# Altium schematic sheet Precision FBR & dB Converter.SchDoc
size Letter; SheetNumber: 3; SheetTotal: 14
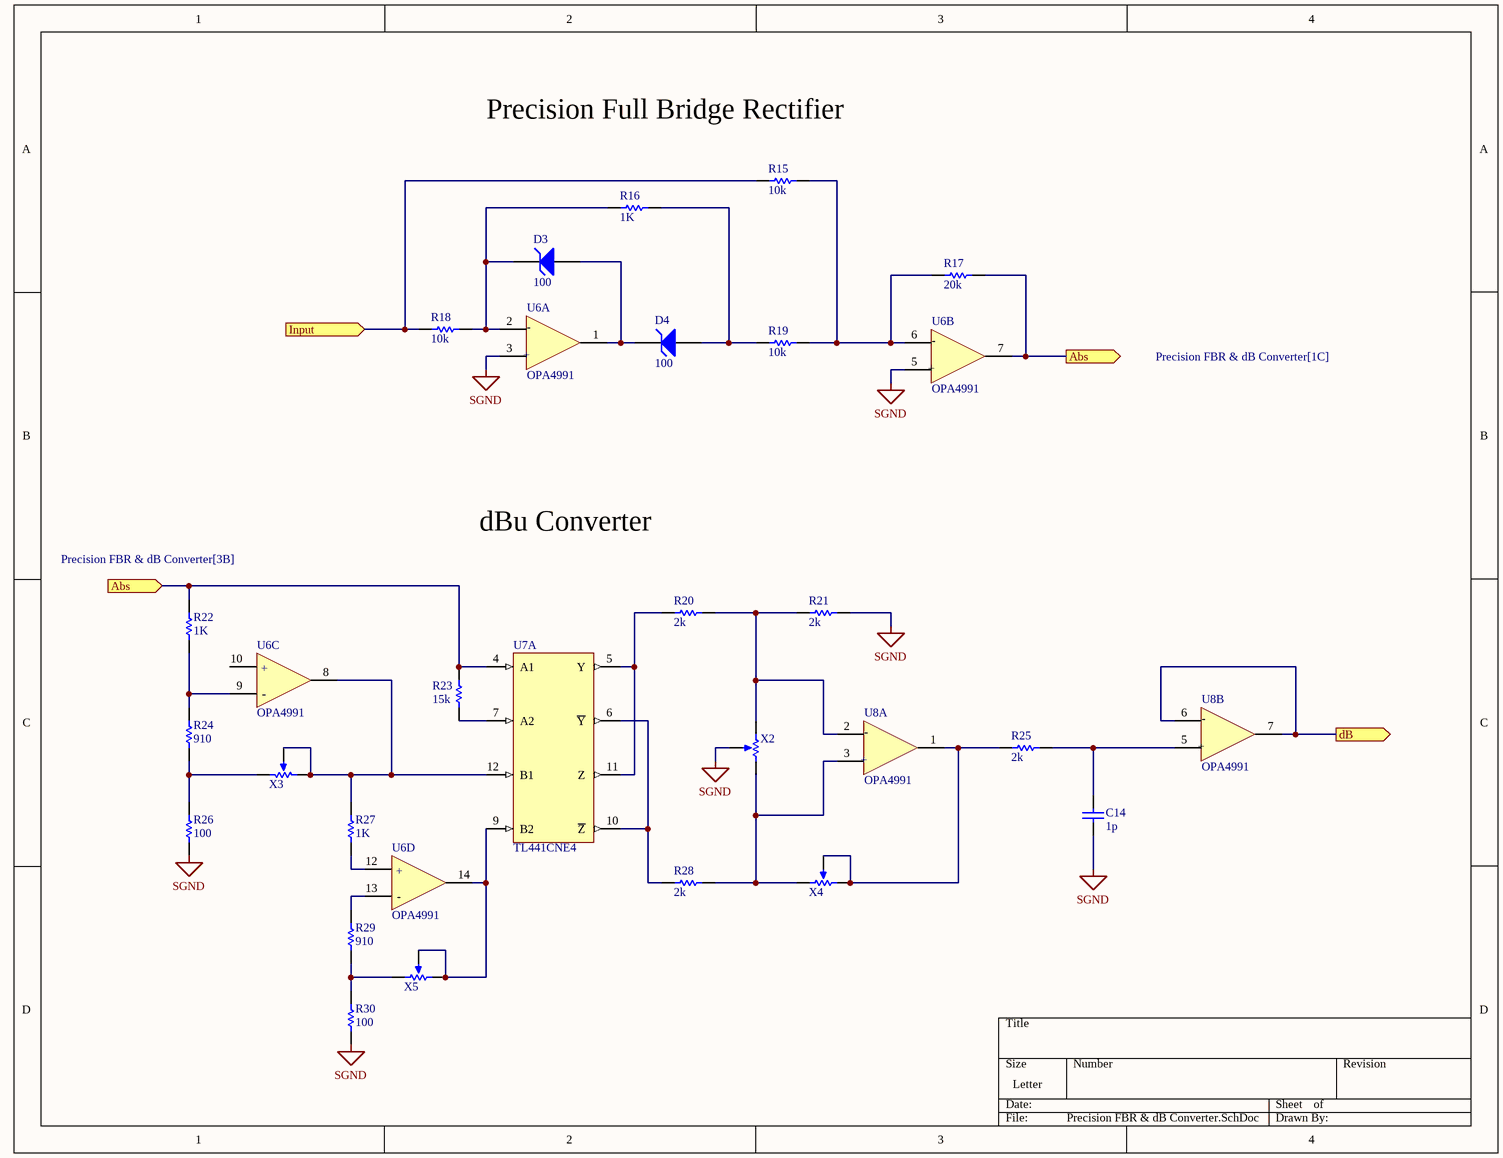
[diagram p0: Precision FBR & dB Converter.SchDoc]

## Parts
C14  value 1p  (hidden comment: Capacitor)
D3  BV: 100  (hidden comment: Zener Diode)
D4  BV: 100  (hidden comment: Zener Diode)
R15  value 10k  (hidden comment: Resistor)
R16  value 1K  (hidden comment: Resistor)
R17  value 20k  (hidden comment: Resistor)
R18  value 10k  (hidden comment: Resistor)
R19  value 10k  (hidden comment: Resistor)
R20  value 2k  (hidden comment: Resistor)
R21  value 2k  (hidden comment: Resistor)
R22  value 1K  (hidden comment: Resistor)
R23  value 15k  (hidden comment: Resistor)
R24  value 910  (hidden comment: Resistor)
R25  value 2k  (hidden comment: Resistor)
R26  value 100  (hidden comment: Resistor)
R27  value 1K  (hidden comment: Resistor)
R28  value 2k  (hidden comment: Resistor)
R29  value 910  (hidden comment: Resistor)
R30  value 100  (hidden comment: Resistor)
U6  OPA4991  [FP-D0014A-IPC_B]  (parts A,B,C,D of 5)
U7  TL441CNE4  [TI-N16]  (part A of 3)
U8  OPA4991  [FP-D0014A-IPC_B]  (parts A,B of 5)
X2  Potentiometer  (value not drawn)
X3  Potentiometer  (value not drawn)
X4  Potentiometer  (value not drawn)
X5  Potentiometer  (value not drawn)

## Ports
Abs (in, see Precision FBR & dB Converter[3B]), Abs (out, see Precision FBR & dB Converter[1C]), dB (out), Input (in)

## Nets
SGND: C14.1 R21.2 R26.1 R30.1 U6.3(IN1+) U6.5(IN2+) X2.3(TAP)
Abs: R17.2 R22.2 R23.1 U6.7(OUT2) U7.4(A1) ; port Abs
dB: U8.6(IN2-) U8.7(OUT2) ; port dB
Input: R15.1 R18.1 ; port Input
NetC14_2: C14.2 R25.2 U8.5(IN2+)
NetD3_1: D3.1(A) D4.2(K) U6.1(OUT1)
NetD3_2: D3.2(K) R16.1 R18.2 U6.2(IN1-)
NetD4_1: D4.1(A) R16.2 R19.1
NetR15_2: R15.2 R17.1 R19.2 U6.6(IN2-)
NetR20_1: R20.1 U7.5(Y) U7.11(Z)
NetR20_2: R20.2 R21.1 U8.2(IN1-) X2.1(TOP)
NetR22_1: R22.1 R24.2 U6.9(IN3-)
NetR23_2: R23.2 U7.7(A2)
NetR24_1: R24.1 R26.2 X3.1(TOP)
NetR25_1: R25.1 U8.1(OUT1) X4.1(TOP) X4.3(TAP)
NetR27_1: R27.1 U6.12(IN4+)
NetR27_2: R27.2 U6.8(OUT3) U7.12(B1) X3.2(BOT) X3.3(TAP)
NetR28_1: R28.1 U7.6(~{Y}) U7.10(~{Z})
NetR28_2: R28.2 U8.3(IN1+) X2.2(BOT) X4.2(BOT)
NetR29_1: R29.1 R30.2 X5.2(BOT)
NetR29_2: R29.2 U6.13(IN4-)
NetU6_14: U6.14(OUT4) U7.9(B2) X5.1(TOP) X5.3(TAP)

Not connected (* = marked no-connect by the designer): U6 10(IN3+)

## Notes on the sheet
- Precision Full Bridge Rectifier
- dBu Converter
- (in symbol OPA4991IDR, part A) -; +
- (in symbol OPA4991IDR, part B) -; +
- (in symbol OPA4991IDR, part C) +; -
- (in symbol OPA4991IDR, part D) +; -

## Library data of the parts
C14 = Capacitor: SimulationGenericComponent: True
D3 D4 = Zener Diode: AF: 1; BV_MAX: 1e99; CJO: 0; EG: 1.11; FC: 0.5; IBV: 0.001; IS: 1e-14; MJSW: 0.33; NTUN: 30; TNOM: 27; XTI: 3; SimulationGenericComponent: True; CJP: 0; CTA: 0; CTP: 0; FCS: 0.5; FV_MAX: 1e99; IKF: 0; IKR: 0; ISR: 1e-14; JSW: 0; JTUN: 0; JTUNSW: 0; KEG: 1; KF: 0; LEVEL: 1; N: 1; NBV: 1; NR: 1; NS: 1; PHP: 1; RS: 0; TCV: 0; TLEV: 0; TLEVC: 0; TM1: 0; TM2: 0; TPB: 0; TPHP: 0; TRS: 0; TRS2: 0; TT: 0; TTT1: 0; TTT2: 0; VJ: 1; XTITUN: 3
R15-R30 = Resistor: TC1: 0; SimulationGenericComponent: True; TC2: 0
U6 U8 = OPA4991IDR: 40-V, DUAL 4.5MHZ, RAIL-TO-RAIL
U7 = TL441CNE4: Logarithmic Amplifier, 0 to 70 degC, 16-pin DIP (N16), Pb-Free (RoHS); Manufacturer: Texas Instruments; Iq(Max)(mA): 23; DatasheetVersion: SLVS328; ComponentLink3URL: http://www.ti.com/litv/pdf/mpdi002c; Eco-Plan: Pb-Free (RoHS); ComponentLink2URL: http://www.ti.com/general/docs/lit/getliterature.tsp?genericPartNumber=TL441&fileType=pdf; SubFamily: Logarithmic Amplifier; ComponentLink3Description: Package Specification; ComponentLink1Description: Manufacturer URL; ComponentLink1URL: http://www.ti.com/; PackageDescription: 16-Pin Plastic In-Line, Body 19.305 x 6.35 mm, Pitch 2.54 mm; PackageVersion: 4040049/E, 12/2002; Code_JEDEC: MS-001; PartNumber: TL441CNE4; ComponentLink2Description: Datasheet; PackageReference: N16; Mounting Technology: Through Hole
X2-X5 = Potentiometer: value: 1k; position: 0.5; SimulationGenericComponent: True